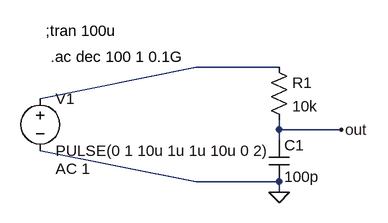
[diagram p0: schematic test.asc]
test.asc, the LTspice schematic file:
Version 4
SHEET 1 880 680
WIRE 224 80 96 80
WIRE -144 128 96 80
WIRE 224 176 224 160
WIRE 320 176 224 176
WIRE 224 192 224 176
WIRE 96 256 -144 208
WIRE 224 256 96 256
WIRE 224 272 224 256
FLAG 224 272 0
FLAG 320 176 out
SYMBOL voltage -144 112 R0
WINDOW 123 24 124 Left 2
WINDOW 39 0 0 Left 0
SYMATTR InstName V1
SYMATTR Value PULSE(0 1 10u 1u 1u 10u 0 2)
SYMATTR Value2 AC 1
SYMBOL res 208 64 R0
SYMATTR InstName R1
SYMATTR Value 10k
SYMBOL cap 208 192 R0
SYMATTR InstName C1
SYMATTR Value 100p
TEXT -136 24 Left 2 !;tran 100u
TEXT -128 64 Left 2 !.ac dec 100 1 0.1G

The netlist it stands for:
* test.asc
V1 N001 0 PULSE(0 1 10u 1u 1u 10u 0 2) AC 1
R1 N001 out 10k
C1 out 0 100p
;tran 100u
.ac dec 100 1 0.1G
.backanno
.end

* Results of the author's LTspice run, read from the files saved beside the schematic
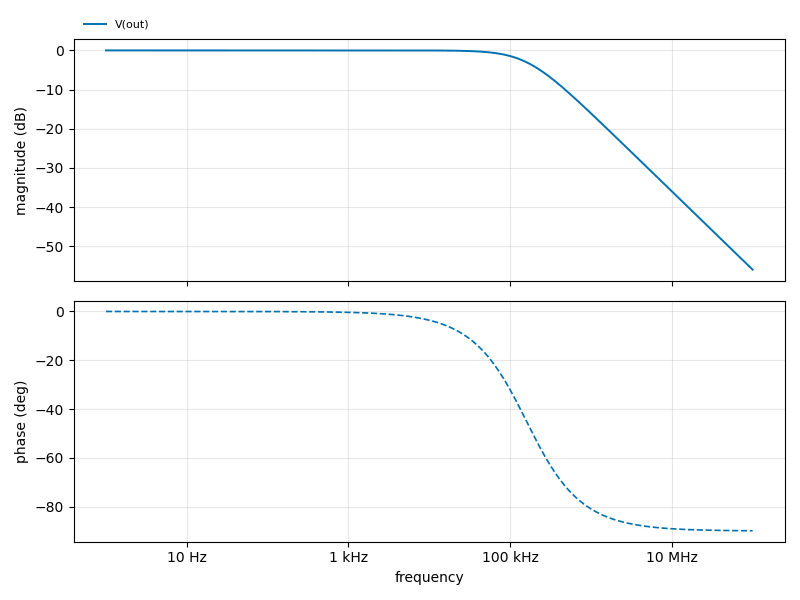
[diagram p1: AC Analysis of test.asc, plotted from the saved traces]
* AC Analysis, 1 run:
*   V(out): -0.00 dB at 1 Hz, -55.96 dB at 100 MHz, peak -0.00 dB at 1 Hz, 3 dB below the peak at 159.1 kHz